# Altium schematic sheet CM_DM_Filter.SchDoc
size A4; CompanyName: Technische Hochschule Nürnberg Georg Simon Ohm; Organization: UltraZohm; Address1: Kesslerplatz 12; Address2: 90489 Nürnberg; Address3: GERMANY; DocumentNumber: 7; SheetNumber: 7; SheetTotal: 12; Website: www.ultrazohm.com
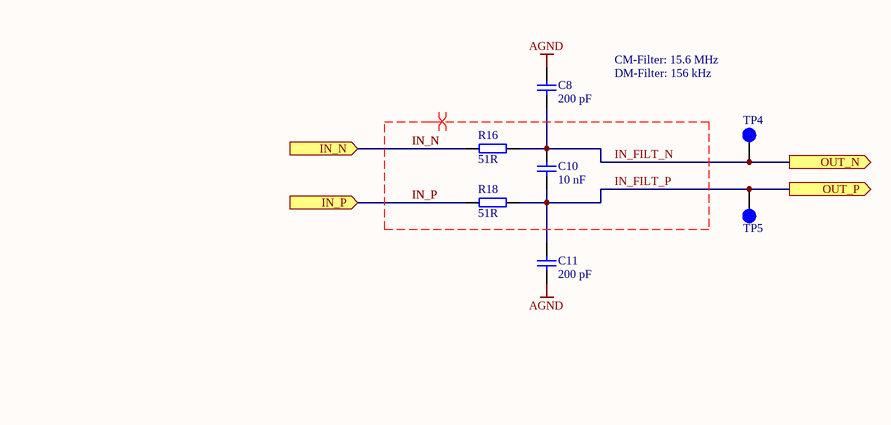
[diagram p0: CM_DM_Filter.SchDoc]

## Parts
C8  200 pF  [C_0402_TE]
C10  10 nF  [C_0402_TE]
C11  200 pF  [C_0402_TE]
R16  51R  [R_0402_TE]
R18  51R  [R_0402_TE]
TP4  Testpoint 1mm  [TP_1mm]  (value not drawn)  (no BOM)
TP5  Testpoint 1mm  [TP_1mm]  (value not drawn)  (no BOM)

## Ports
IN_N (in), IN_P (in), OUT_N (out), OUT_P (out)

## Nets
AGND: C8.1 C11.2
IN_FILT_N: C8.2 C10.1 R16.2 TP4.1 ; port OUT_N
IN_FILT_P: C10.2 C11.1 R18.2 TP5.1 ; port OUT_P
IN_N: R16.1 ; port IN_N
IN_P: R18.1 ; port IN_P

## Layout directives
differential pair: IN_FILT_N, IN_FILT_P, IN_N, IN_P

## Notes on the sheet
- CM-Filter: 15.6 MHz
- DM-Filter: 156 kHz
- Title
- Revision:
- Design Engineer:
- Date:
- Project:
- Sheet
- of

## Library data of the parts
C8 C11 = UZgen_C_0402_200pF_50V_NP0: Generic capacitor; Manufacturer: UZgen; Voltage: 50V; Tolerance: 10 %; Created from: UZgenTool; Manufacturer Part Number: UZgen_C_0402_200pF_50V_NP0; PartID: 5668; Created On: 13.12.2024 11:08:45; Value: 200 pF; Device Package: 0402; Technology: NP0; Mounting Type: SMD; Last Updated: 13.12.2024 11:08:45
C10 = UZgen_C_0402_10nF_50V_NP0: Generic capacitor; Manufacturer: UZgen; Voltage: 50V; Tolerance: 10 %; Created from: UZgenTool; Manufacturer Part Number: UZgen_C_0402_10nF_50V_NP0; PartID: 5709; Created On: 13.12.2024 11:08:46; Value: 10 nF; Device Package: 0402; Technology: NP0; Mounting Type: SMD; Last Updated: 13.12.2024 11:08:46
R16 R18 = UZgen_R_0402_51R: Generic resistor; Manufacturer: UZgen; Tolerance: 1 %; Created from: UZgenTool; Manufacturer Part Number: UZgen_R_0402_51R; PartID: 46; Created On: 02.07.2024 17:29:45; Value: 51R; Device Package: 0402; Mounting Type: SMD; Last Updated: 02.07.2024 17:29:45
TP4 TP5 = Testpoint_1mm: Manufacturer: UltraZohm; Created from: AGeiger; Created: 2018_06_25_AGeiger; Value: Testpoint 1mm; Manufacturer Part Number: Testpoint_1mm; PartID: 9; Created On: 20.09.2022 13:14:57; Component Type: Testpoint; Last Updated: 14.08.2025 11:47:07; Supplier 1: NULL; Supplier Part Number 1: NULL; Type: Testpoint; Live Cycle Status: 1